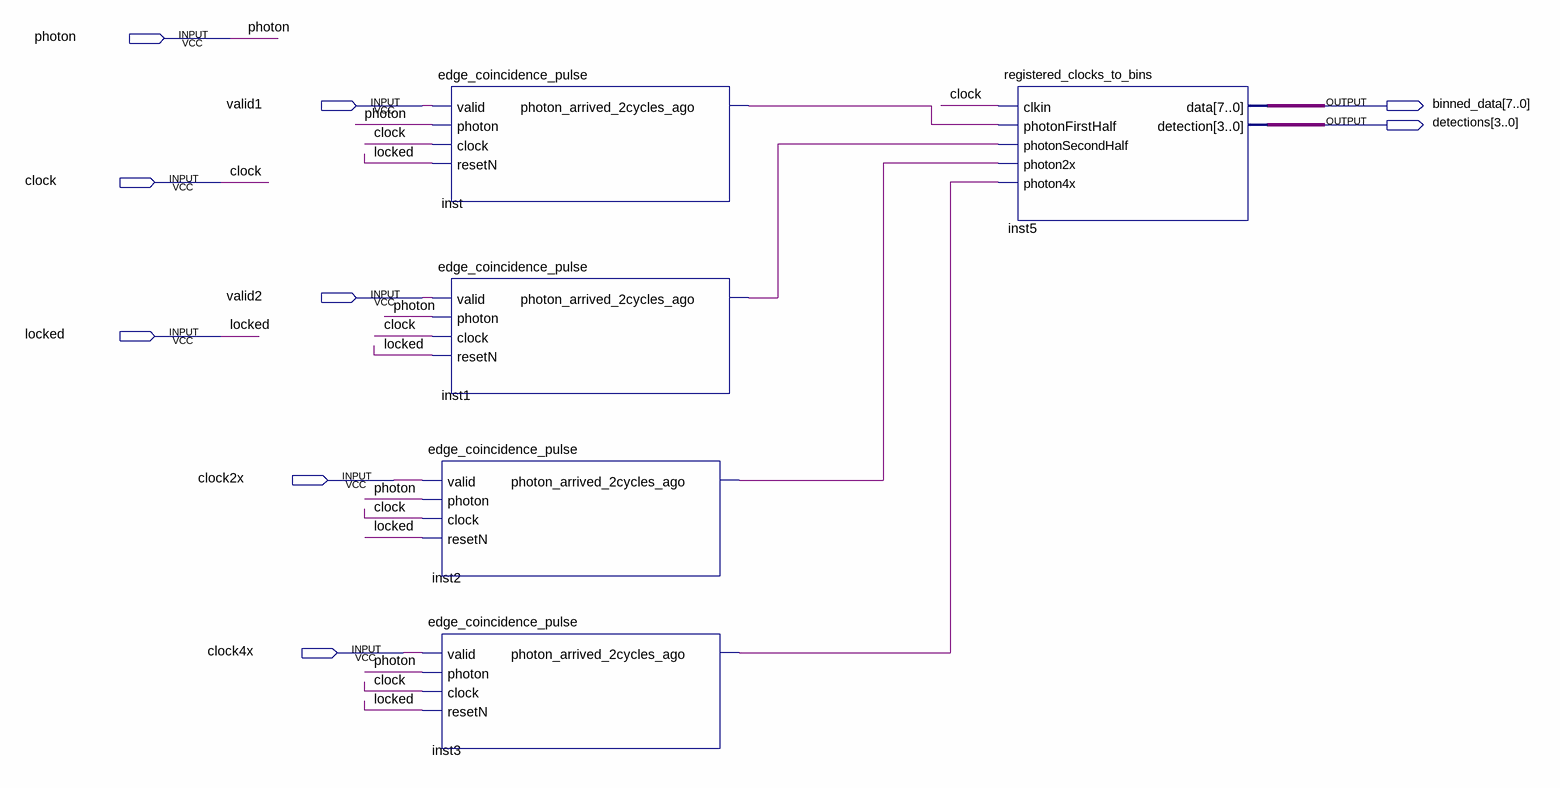
[diagram p0: schematic sheet]
// Quartus schematic photon_sorter.bdf as structural Verilog: 5 symbols, 9 pins
module photon_sorter (
  input  photon,
  input  valid1,
  input  clock,
  input  valid2,
  input  locked,
  input  clock2x,
  input  clock4x,
  output [7:0] binned_data,
  output [3:0] detections
);

  wire inst1_photon_arrived_2cycles_ago, inst2_photon_arrived_2cycles_ago, inst3_photon_arrived_2cycles_ago,
       inst_photon_arrived_2cycles_ago;

  edge_coincidence_pulse inst (
    .valid(valid1), .photon(photon), .clock(clock), .resetN(locked),
    .photon_arrived_2cycles_ago(inst_photon_arrived_2cycles_ago));
  edge_coincidence_pulse inst1 (
    .valid(valid2), .photon(photon), .clock(clock), .resetN(locked),
    .photon_arrived_2cycles_ago(inst1_photon_arrived_2cycles_ago));
  edge_coincidence_pulse inst2 (
    .valid(clock2x), .photon(photon), .clock(clock), .resetN(locked),
    .photon_arrived_2cycles_ago(inst2_photon_arrived_2cycles_ago));
  edge_coincidence_pulse inst3 (
    .valid(clock4x), .photon(photon), .clock(clock), .resetN(locked),
    .photon_arrived_2cycles_ago(inst3_photon_arrived_2cycles_ago));
  registered_clocks_to_bins inst5 (
    .clkin(clock), .photonFirstHalf(inst_photon_arrived_2cycles_ago),
    .photonSecondHalf(inst1_photon_arrived_2cycles_ago), .photon2x(inst2_photon_arrived_2cycles_ago),
    .photon4x(inst3_photon_arrived_2cycles_ago), .data(binned_data), .detection(detections));
endmodule
